# EAGLE schematic germanium_diode_radio (EAGLE 9.6.2)
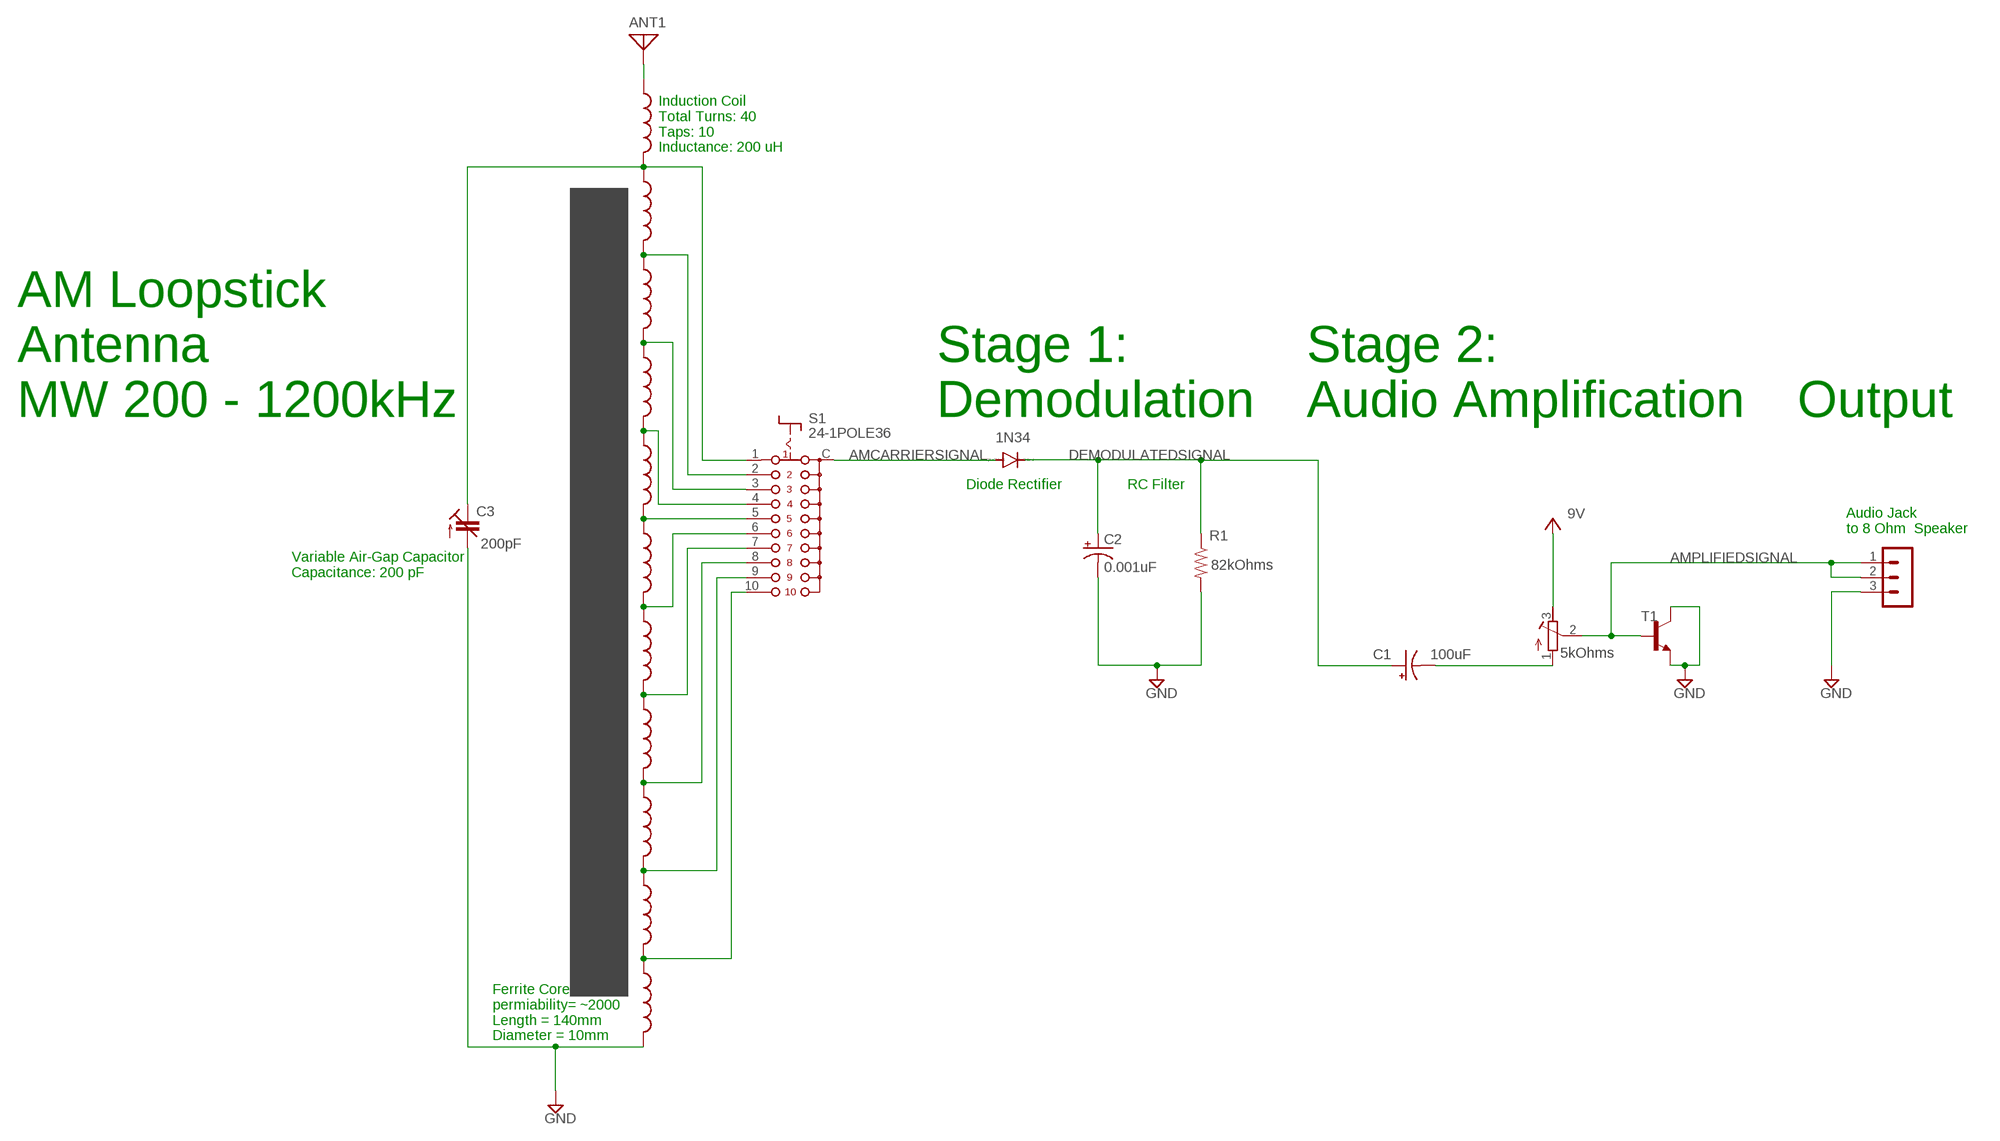
[diagram p0: schematic, sheet 1]

## Parts
1N34  AA112  [DO07]
ANT1  ANTENNA  [PAD-01]
C1  100uF  CPOL-USE1.8-4  [E1,8-4]
C2  0.001uF  CPOL-USE1.8-4  [E1,8-4]
C3  200pF  C-TRIMMTZ03  [CTRIMTZ03]
L1  L-US0204/7  [0204/7]
L2  L-US0204/7  [0204/7]
L3  L-US0204/7  [0204/7]
L4  L-US0204/7  [0204/7]
L5  L-US0204/7  [0204/7]
L6  L-US0204/7  [0204/7]
L7  L-US0204/7  [0204/7]
L8  L-US0204/7  [0204/7]
L9  L-US0204/7  [0204/7]
L10  L-US0204/7  [0204/7]
L11  L-US0204/7  [0204/7]
R1  82kOhms  R-US_0204/7  [0204/7]
R2  5kOhms  R-TRIMM3296W  [RTRIM3296W]
S1  24-1POLE36  [24-1POLE36]
SV1  MA03-1  [MA03-1]
T1  MPS2222A-NPN-TO92-CBE  [TO92-CBE]

## Nets
AMCARRIERSIGNAL: 1N34.A S1.C(S)
AMPLIFIEDSIGNAL: R2.2(S) SV1.1 SV1.2 T1.B
DEMODULATEDSIGNAL: 1N34.C C1.+ C2.+ R1.1
GND: C2.- C3.2(A) L11.2 R1.2 SV1.3 T1.C T1.E
N$1: C3.1(E) L4.1 L10.2 S1.1
N$2: L3.1 L4.2 S1.2
N$3: L1.1 L3.2 S1.3
N$4: L1.2 L2.1 S1.4
N$5: L2.2 L5.1 S1.5
N$6: L5.2 L6.1 S1.6
N$7: L6.2 L7.1 S1.7
N$8: L7.2 L8.1 S1.8
N$9: L8.2 L9.1 S1.9
N$10: L9.2 L11.1 S1.10
N$11: ANT1.1 L10.1
N$13: C1.- R2.1(A)
VCC: R2.3(E) ; supply symbol labelled 9V

## Notes on the sheet
- Induction Coil
  Total Turns: 40
  Taps: 10
  Inductance: 200 uH
- AM Loopstick
  Antenna
  MW 200 - 1200kHz
- Stage 1:
  Demodulation
- Stage 2:
  Audio Amplification
- Output
- Diode Rectifier | RC Filter
- Audio Jack
  to 8 Ohm  Speaker
- Variable Air-Gap Capacitor
  Capacitance: 200 pF
- Ferrite Core
  permiability= ~2000
  Length = 140mm
  Diameter = 10mm

## Library data of the parts
1N34 = diode:AA112: DIODE germanium
ANT1 = discrete:ANTENNA: Antenna
C1 C2 = rcl:CPOL-US: POLARIZED CAPACITOR, American symbol; SPICEPREFIX: C
C3 = rcl:C-TRIMM: Trimm capacitor; SPICEPREFIX: C
L1-L11 = rcl:L-US: INDUCTOR, American symbol; SPICEPREFIX: L
R1 = rcl:R-US_: RESISTOR, American symbol; SPICEPREFIX: R
R2 = rcl:R-TRIMM: Trimm resistor; SPICEMODEL: X; SPICEPREFIXL: POT
S1 = switch:24-1POLE36: SERIES 24 Rotary Switches one pole 36° Source: www.grayhill.com .. J-28.pdf
SV1 = con-lstb:MA03-1: PIN HEADER; OC_FARNELL: unknown; OC_NEWARK: unknown
T1 = transistor:*-NPN-: NPN Transistror BF959 corrected 2008.03.06